# EAGLE schematic Schematic (EAGLE 9.7.0)
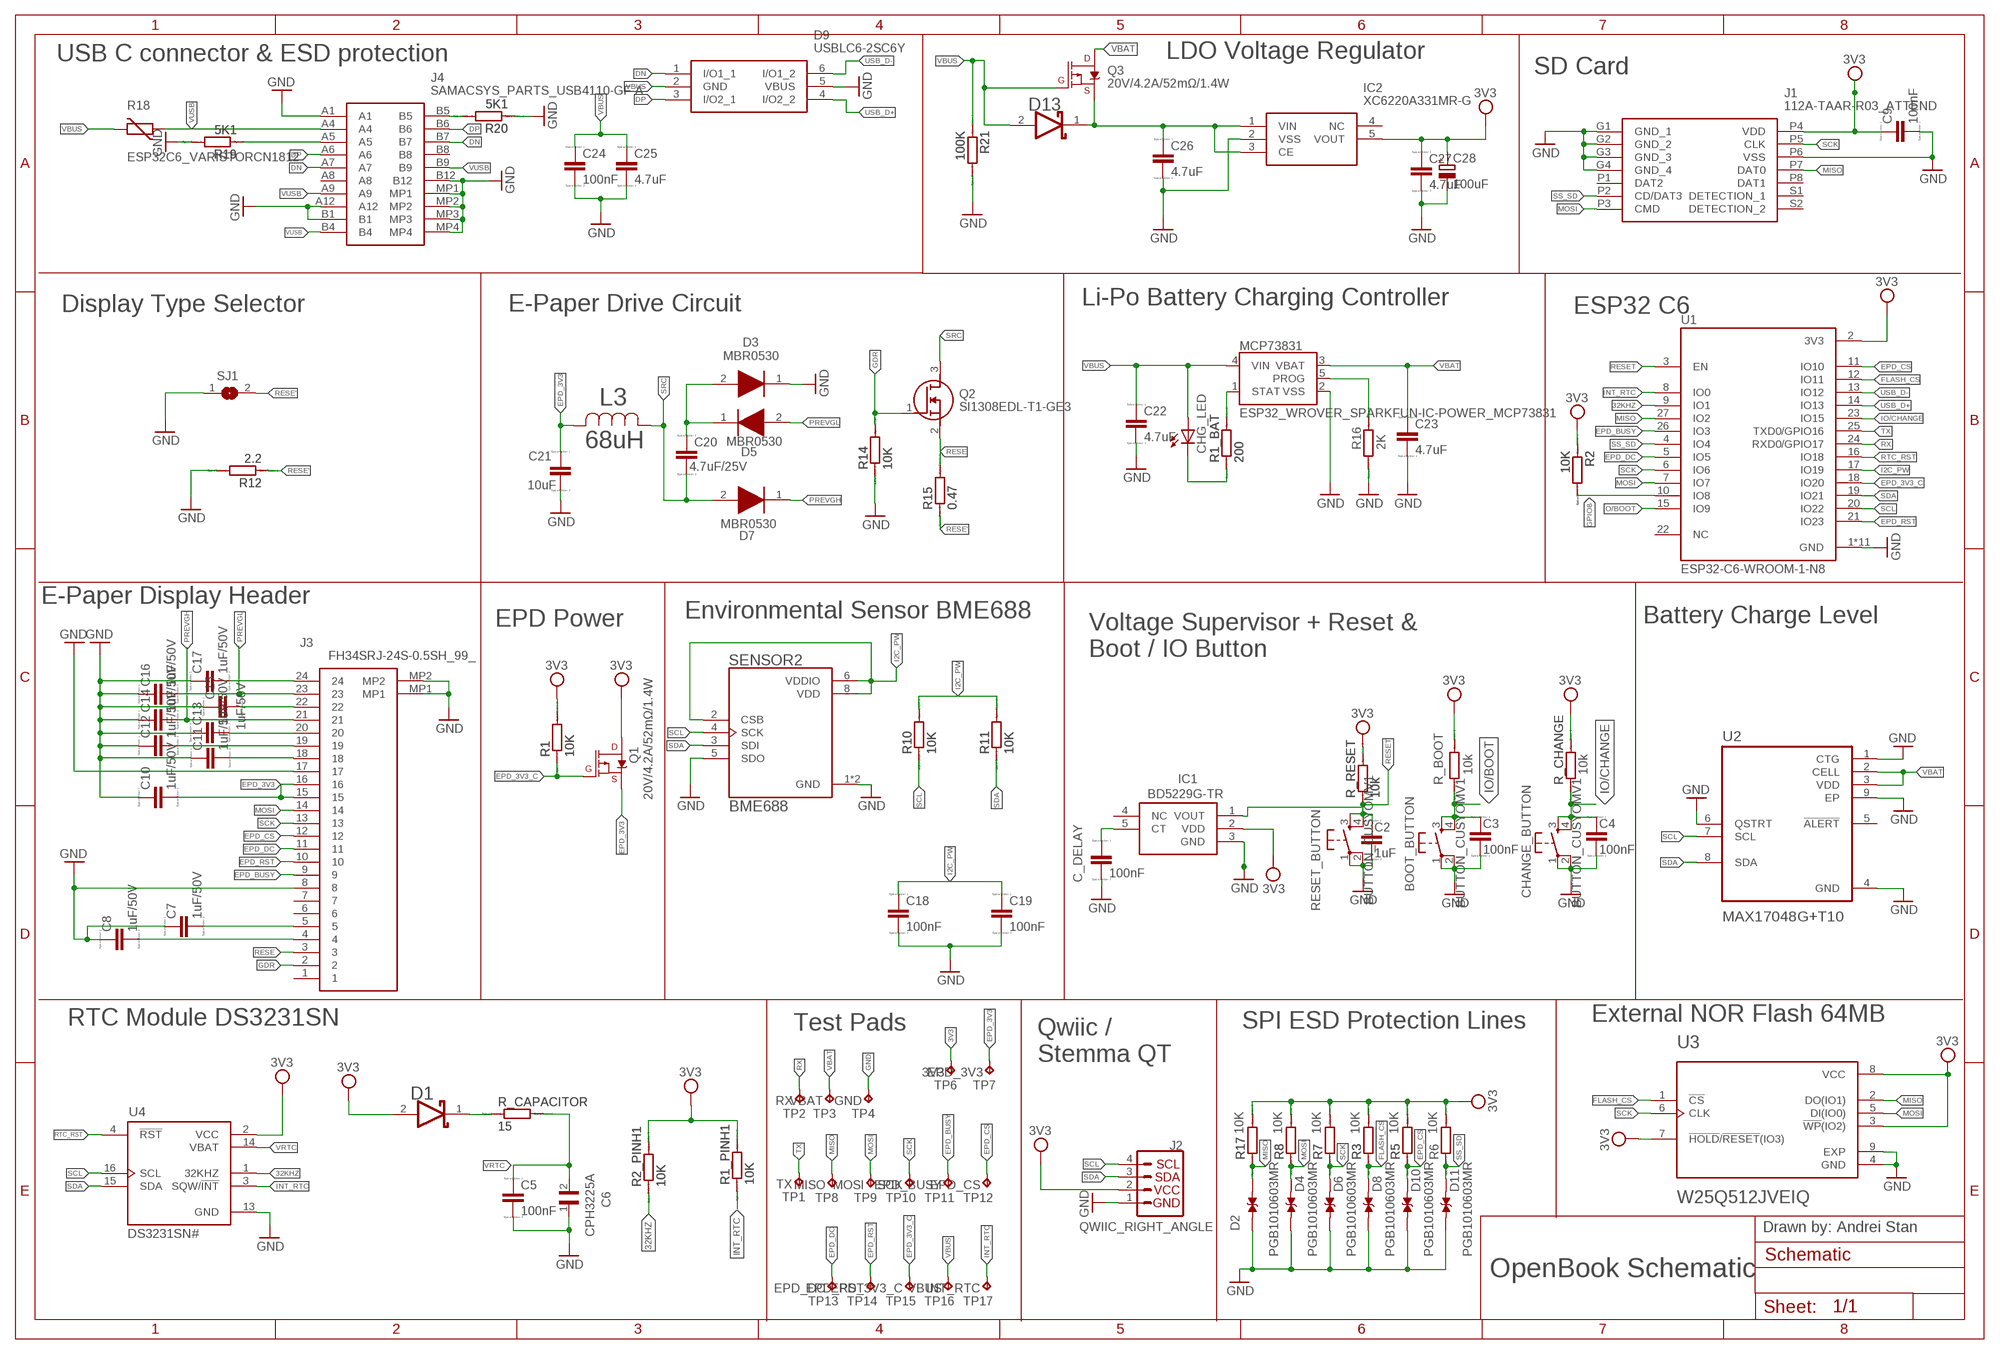
[diagram p0: schematic, sheet 1]

## Parts
BOOT_BUTTON  BUTTON_CUSYOMV1  [MYBUTTON]
C2  1uF  EAGLE-LTSPICE_CC0402  [EAGLE-LTSPICE_C0402]
C3  100nF  EAGLE-LTSPICE_CC0402  [EAGLE-LTSPICE_C0402]
C4  100nF  EAGLE-LTSPICE_CC0402  [EAGLE-LTSPICE_C0402]
C5  100nF  EAGLE-LTSPICE_CC0402  [EAGLE-LTSPICE_C0402]
C6  CPH3225A  [CAPCP3225X100N]
C7  1uF/50V  EAGLE-LTSPICE_CC0402  [EAGLE-LTSPICE_C0402]
C8  1uF/50V  EAGLE-LTSPICE_CC0402  [EAGLE-LTSPICE_C0402]
C9  100nF  EAGLE-LTSPICE_CC0402  [EAGLE-LTSPICE_C0402]
C10  1uF/50V  EAGLE-LTSPICE_CC0402  [EAGLE-LTSPICE_C0402]
C11  1uF/50V  EAGLE-LTSPICE_CC0402  [EAGLE-LTSPICE_C0402]
C12  1uF/50V  EAGLE-LTSPICE_CC0402  [EAGLE-LTSPICE_C0402]
C13  1uF/50V  EAGLE-LTSPICE_CC0402  [EAGLE-LTSPICE_C0402]
C14  1uF/50V  EAGLE-LTSPICE_CC0402  [EAGLE-LTSPICE_C0402]
C15  1uF/50V  EAGLE-LTSPICE_CC0402  [EAGLE-LTSPICE_C0402]
C16  1uF/50V  EAGLE-LTSPICE_CC0402  [EAGLE-LTSPICE_C0402]
C17  1uF/50V  EAGLE-LTSPICE_CC0402  [EAGLE-LTSPICE_C0402]
C18  100nF  EAGLE-LTSPICE_CC0402  [EAGLE-LTSPICE_C0402]
C19  100nF  EAGLE-LTSPICE_CC0402  [EAGLE-LTSPICE_C0402]
C20  4.7uF/25V  ESP32_WROVER_EAGLE-LTSPICE_CC0402  [ESP32_WROVER_EAGLE-LTSPICE_C0402]
C21  10uF  ESP32_WROVER_EAGLE-LTSPICE_CC0402  [ESP32_WROVER_EAGLE-LTSPICE_C0402]
C22  4.7uF  EAGLE-LTSPICE_CC0402  [EAGLE-LTSPICE_C0402]
C23  4.7uF  EAGLE-LTSPICE_CC0402  [EAGLE-LTSPICE_C0402]
C24  100nF  ESP32_WROVER_EAGLE-LTSPICE_CC0402  [ESP32_WROVER_EAGLE-LTSPICE_C0402]
C25  4.7uF  ESP32_WROVER_EAGLE-LTSPICE_CC0402  [ESP32_WROVER_EAGLE-LTSPICE_C0402]
C26  4.7uF  ESP32_WROVER_EAGLE-LTSPICE_CC0402  [ESP32_WROVER_EAGLE-LTSPICE_C0402]
C27  4.7uF  ESP32_WROVER_EAGLE-LTSPICE_CC0402  [ESP32_WROVER_EAGLE-LTSPICE_C0402]
C28  100uF  RCL_CPOL-EUCT3528  [RCL_CT3528]
C_DELAY  100nF  EAGLE-LTSPICE_CC0402  [EAGLE-LTSPICE_C0402]
CHANGE_BUTTON  BUTTON_CUSYOMV1  [MYBUTTON]
CHG_LED  ADAFRUIT_LEDCHIP-LED0603  [ADAFRUIT_CHIP-LED0603]
D1  ESP32_WROVER_AVX---SD0805S020S1R0_AVX_SD0805S020S1R0_0_0AVX_SD0805S020S1R0_0_0  [ESP32_WROVER_AVX---SD0805S020S1R0_AVX_SD0805S020S1R0_0]
D2  PGB1010603MR  [DIOC1608X36N]
D3  MBR0530  [SOD3716X135N]
D4  PGB1010603MR  [DIOC1608X36N]
D5  MBR0530  [SOD3716X135N]
D6  PGB1010603MR  [DIOC1608X36N]
D7  MBR0530  [SOD3716X135N]
D8  PGB1010603MR  [DIOC1608X36N]
D9  USBLC6-2SC6Y  [SOT95P280X145-6N]
D10  PGB1010603MR  [DIOC1608X36N]
D11  PGB1010603MR  [DIOC1608X36N]
D13  ESP32_WROVER_AVX---SD0805S020S1R0_AVX_SD0805S020S1R0_0_0AVX_SD0805S020S1R0_0_0  [ESP32_WROVER_AVX---SD0805S020S1R0_AVX_SD0805S020S1R0_0]
IC1  BD5229G-TR  [SOT95P280X125-5N]
IC2  XC6220A331MR-G  [SOT95P280X120-5N]
J1  112A-TAAR-R03_ATTEND  [112ATAARR03ATTEND]
J2  QWIIC_RIGHT_ANGLE  QWIIC_CONNECTORJS-1MM  [JST04_1MM_RA]
J3  FH34SRJ-24S-0.5SH_99_  [FH34SRJ24S05SH99]
J4  SAMACSYS_PARTS_USB4110-GF-A  [SAMACSYS_PARTS_USB4110GFA]
L3  68uH  744043680IND_4828-WE-TPC_WRE  [IND_4828-WE-TPC_WRE]
MCP73831  ESP32_WROVER_SPARKFUN-IC-POWER_MCP73831  [ESP32_WROVER_SPARKFUN-IC-POWER_SOT23-5]
Q1  20V/4.2A/52mΩ/1.4W  ESP32_WROVER_SPARKFUN-DISCRETESEMI_MOSFET_PCH-DMG2305UX-7  [ESP32_WROVER_SPARKFUN-DISCRETESEMI_SOT23-3]
Q2  SI1308EDL-T1-GE3  [SOT65P210X110-3N]
Q3  20V/4.2A/52mΩ/1.4W  ESP32_WROVER_SPARKFUN-DISCRETESEMI_MOSFET_PCH-DMG2305UX-7  [ESP32_WROVER_SPARKFUN-DISCRETESEMI_SOT23-3]
R1  10K  ESP32_WROVER_EAGLE-LTSPICE_RR0402  [ESP32_WROVER_EAGLE-LTSPICE_R0402]
R1_BAT  200  ESP32_WROVER_EAGLE-LTSPICE_RR0402  [ESP32_WROVER_EAGLE-LTSPICE_R0402]
R1_PINH1  10K  ESP32_WROVER_EAGLE-LTSPICE_RR0402  [ESP32_WROVER_EAGLE-LTSPICE_R0402]
R2  10K  ESP32_WROVER_EAGLE-LTSPICE_RR0402  [ESP32_WROVER_EAGLE-LTSPICE_R0402]
R2_PINH1  10K  ESP32_WROVER_EAGLE-LTSPICE_RR0402  [ESP32_WROVER_EAGLE-LTSPICE_R0402]
R3  10K  ESP32_WROVER_EAGLE-LTSPICE_RR0402  [ESP32_WROVER_EAGLE-LTSPICE_R0402]
R5  10K  ESP32_WROVER_EAGLE-LTSPICE_RR0402  [ESP32_WROVER_EAGLE-LTSPICE_R0402]
R6  10K  ESP32_WROVER_EAGLE-LTSPICE_RR0402  [ESP32_WROVER_EAGLE-LTSPICE_R0402]
R7  10K  ESP32_WROVER_EAGLE-LTSPICE_RR0402  [ESP32_WROVER_EAGLE-LTSPICE_R0402]
R8  10K  ESP32_WROVER_EAGLE-LTSPICE_RR0402  [ESP32_WROVER_EAGLE-LTSPICE_R0402]
R10  10K  ESP32_WROVER_EAGLE-LTSPICE_RR0402  [ESP32_WROVER_EAGLE-LTSPICE_R0402]
R11  10K  ESP32_WROVER_EAGLE-LTSPICE_RR0402  [ESP32_WROVER_EAGLE-LTSPICE_R0402]
R12  2.2  ESP32_WROVER_EAGLE-LTSPICE_RR0402  [ESP32_WROVER_EAGLE-LTSPICE_R0402]
R14  10K  ESP32_WROVER_EAGLE-LTSPICE_RR0402  [ESP32_WROVER_EAGLE-LTSPICE_R0402]
R15  0.47  ESP32_WROVER_EAGLE-LTSPICE_RR0402  [ESP32_WROVER_EAGLE-LTSPICE_R0402]
R16  2K  ESP32_WROVER_EAGLE-LTSPICE_RR0402  [ESP32_WROVER_EAGLE-LTSPICE_R0402]
R17  10K  ESP32_WROVER_EAGLE-LTSPICE_RR0402  [ESP32_WROVER_EAGLE-LTSPICE_R0402]
R18  ESP32C6_VARISTORCN1812  [ESP32C6_VARISTOR_CT/CN1812]
R19  5K1  ESP32_WROVER_EAGLE-LTSPICE_RR0402  [ESP32_WROVER_EAGLE-LTSPICE_R0402]
R20  5K1  ESP32_WROVER_EAGLE-LTSPICE_RR0402  [ESP32_WROVER_EAGLE-LTSPICE_R0402]
R21  100K  ESP32_WROVER_EAGLE-LTSPICE_RR0402  [ESP32_WROVER_EAGLE-LTSPICE_R0402]
R_BOOT  10k  ESP32_WROVER_EAGLE-LTSPICE_RR0402  [ESP32_WROVER_EAGLE-LTSPICE_R0402]
R_CAPACITOR  15  ESP32_WROVER_EAGLE-LTSPICE_RR0402  [ESP32_WROVER_EAGLE-LTSPICE_R0402]
R_CHANGE  10k  ESP32_WROVER_EAGLE-LTSPICE_RR0402  [ESP32_WROVER_EAGLE-LTSPICE_R0402]
R_RESET  10k  ESP32_WROVER_EAGLE-LTSPICE_RR0402  [ESP32_WROVER_EAGLE-LTSPICE_R0402]
RESET_BUTTON  BUTTON_CUSYOMV1  [MYBUTTON]
SENSOR2  BME688  ESP32_WROVER_BME680_BME680  [ESP32_WROVER_BME680_PSON80P300X300X100-8N]
SJ1  SJ  [SJ]
TP1  TPTP20R  [TP20R]
TP2  TPTP20R  [TP20R]
TP3  TPTP20R  [TP20R]
TP4  TPTP20R  [TP20R]
TP6  TPTP20R  [TP20R]
TP7  TPTP20R  [TP20R]
TP8  TPTP20R  [TP20R]
TP9  TPTP20R  [TP20R]
TP10  TPTP20R  [TP20R]
TP11  TPTP20R  [TP20R]
TP12  TPTP20R  [TP20R]
TP13  TPTP20R  [TP20R]
TP14  TPTP20R  [TP20R]
TP15  TPTP20R  [TP20R]
TP16  TPTP20R  [TP20R]
TP17  TPTP20R  [TP20R]
U1  ESP32-C6-WROOM-1-N8  [XCVR_ESP32-C6-WROOM-1-N8]
U2  MAX17048G+T10  [SON50P200X200X80-9N]
U3  W25Q512JVEIQ  [SON127P600X800X80-9N]
U4  DS3231SN#  [SOIC127P1032X265-16N]

## Nets
3V3: C9.1 C27.1 C28.+ D1.2(ANODE) IC1.2(VDD) IC2.5(VOUT) J1.P4(VDD) J2.2 Q1.3(D) R1.2 R1_PINH1.2 R2.1 R2_PINH1.2 R3.2 R5.2 R6.2 R7.2 R8.2 R17.2 R_BOOT.2 R_CHANGE.2 R_RESET.2 TP6.TP U1.2(3V3) U3.3(!WP!(IO2)) U3.7(!HOLD!/!RESET!(IO3)) U3.8(VCC) U4.2(VCC)
32KHZ: R2_PINH1.1 U1.9(IO1) U4.1(32KHZ)
DN: D9.1(I/O1_1) J4.A7 J4.B7
DP: D9.3(I/O2_1) J4.A6 J4.B6
EPD_3V3: C10.2 C21.1 J3.15 J3.16 L3.2 Q1.2(S) TP7.TP
EPD_3V3_C: Q1.1(G) R1.1 TP15.TP U1.18(IO20)
EPD_BUSY: J3.9 TP11.TP U1.26(IO3)
EPD_CS: D10.2 J3.12 R5.1 TP12.TP U1.11(IO10)
EPD_DC: J3.11 TP13.TP U1.5(IO5)
EPD_RST: J3.10 TP14.TP U1.21(IO23)
FLASH_CS: D8.2 R3.1 U1.12(IO11) U3.1(!CS)
GDR: J3.2 Q2.1(G) R14.2
GND: BOOT_BUTTON.1 BOOT_BUTTON.2 C2.2 C3.2 C4.2 C5.2 C6.1 C7.1 C8.1 C9.2 C10.1 C11.1 C12.1 C13.1 C14.1 C15.1 C16.1 C17.1 C18.2 C19.2 C21.2 C22.2 C23.2 C24.2 C25.2 C26.2 C27.2 C28.- C_DELAY.2 CHANGE_BUTTON.1 CHANGE_BUTTON.2 D2.1 D3.1(K) D4.1 D6.1 D8.1 D9.5(VBUS) D10.1 D11.1 IC1.3(GND) IC2.2(VSS) J1.G1(GND_1) J1.G2(GND_2) J1.G3(GND_3) J1.G4(GND_4) J1.P6(VSS) J2.1 J3.8 J3.17 J3.MP1 J3.MP2 J4.A1 J4.A12 J4.B1 J4.B12 J4.MP1 J4.MP2 J4.MP3 J4.MP4 MCP73831.2(VSS) R12.2 R14.1 R16.1 R19.2 R20.1 R21.2 RESET_BUTTON.1 RESET_BUTTON.2 SENSOR2.1(GND) SENSOR2.5(SDO) SENSOR2.7(GND) SJ1.1 TP4.TP U1.1(GND) U1.28(GND) U1.29_1(GND) U1.29_2(GND) U1.29_3(GND) U1.29_4(GND) U1.29_5(GND) U1.29_6(GND) U1.29_7(GND) U1.29_8(GND) U1.29_9(GND) U2.1(CTG) U2.4(GND) U2.6(QSTRT) U2.9(EP) U3.4(GND) U3.9(EXP) U4.13(GND)
GPIO8: R2.2 U1.10(IO8)
I2C_PW: C18.1 C19.1 R10.2 R11.2 SENSOR2.2(CSB) SENSOR2.6(VDDIO) SENSOR2.8(VDD) U1.17(IO19)
INT_RTC: R1_PINH1.1 TP17.TP U1.8(IO0) U4.3(SQW/!INT)
IO/BOOT: BOOT_BUTTON.3 BOOT_BUTTON.4 C3.1 R_BOOT.1 U1.15(IO9)
IO/CHANGE: C4.1 CHANGE_BUTTON.3 CHANGE_BUTTON.4 R_CHANGE.1 U1.23(IO15)
MISO: D2.2 J1.P7(DAT0) R17.1 TP8.TP U1.27(IO2) U3.2(DO(IO1))
MOSI: D4.2 J1.P3(CMD) J3.14 R8.1 TP9.TP U1.7(IO7) U3.5(DI(IO0))
N$1: C_DELAY.1 IC1.5(CT)
N$3: D1.1(CATHODE) R_CAPACITOR.1
N$7: C8.2 J3.4
N$8: C7.2 J3.5
N$9: C20.1 D3.2(A) D5.1(K)
N$10: MCP73831.1(STAT) R1_BAT.2
N$11: J4.A5 R19.1
N$12: CHG_LED.C R1_BAT.1
N$13: MCP73831.5(PROG) R16.2
N$16: J4.B5 R20.2
N$18: C26.1 D13.1(CATHODE) IC2.1(VIN) IC2.3(CE) Q3.2(S)
N$19: C11.2 J3.18
N$20: C12.2 J3.19
N$21: C13.2 J3.20
N$23: C15.2 J3.22
N$25: C17.2 J3.24
PREVGH: C14.2 D7.1(K) J3.21
PREVGL: C16.2 D5.2(A) J3.23
RESE: J3.3 Q2.2(S) R15.2
RESE': R12.1 R15.1 SJ1.2
RESET: C2.1 IC1.1(VOUT) R_RESET.1 RESET_BUTTON.3 RESET_BUTTON.4 U1.3(EN)
RTC_RST: U1.16(IO18) U4.4(!RST)
RX: TP2.TP U1.24(RXD0/GPIO17)
SCK: D6.2 J1.P5(CLK) J3.13 R7.1 TP10.TP U1.6(IO6) U3.6(CLK)
SCL: J2.4 R10.1 SENSOR2.4(SCK) U1.20(IO22) U2.7(SCL) U4.16(SCL)
SDA: J2.3 R11.1 SENSOR2.3(SDI) U1.19(IO21) U2.8(SDA) U4.15(SDA)
SRC: C20.2 D7.2(A) L3.1 Q2.3(D)
SS_SD: D11.2 J1.P2(CD/DAT3) R6.1 U1.4(IO4)
TX: TP1.TP U1.25(TXD0/GPIO16)
USB_D+: D9.4(I/O2_2) U1.14(IO13)
USB_D-: D9.6(I/O1_2) U1.13(IO12)
VBAT: C23.1 MCP73831.3(VBAT) Q3.3(D) TP3.TP U2.2(CELL) U2.3(VDD)
VBUS: C22.1 C24.1 C25.1 CHG_LED.A D9.2(GND) D13.2(ANODE) MCP73831.4(VIN) Q3.1(G) R18.2 R21.1 TP16.TP
VRTC: C5.1 C6.2 R_CAPACITOR.2 U4.14(VBAT)
VUSB: J4.A4 J4.A9 J4.B4 J4.B9 R18.1
Unconnected: IC1.4(NC) IC2.4(NC) J1.P1(DAT2) J1.P8(DAT1) J1.S1(DETECTION_1) J1.S2(DETECTION_2) J3.1 J3.6 J3.7 J4.A8 J4.B8 U1.22(NC) U2.5(!ALERT)

## Notes on the sheet
- USB C connector & ESD protection | LDO Voltage Regulator | SD Card
- Display Type Selector | E-Paper Drive Circuit | Li-Po Battery Charging Controller | ESP32 C6
- E-Paper Display Header
- Environmental Sensor BME688 | Battery Charge Level
- EPD Power
- Voltage Supervisor + Reset &
  Boot / IO Button
- External NOR Flash 64MB
- RTC Module DS3231SN | Test Pads | SPI ESD Protection Lines
- Qwiic /
  Stemma QT
- Drawn by: Andrei Stan
- OpenBook Schematic

## Library data of the parts
BOOT_BUTTON CHANGE_BUTTON RESET_BUTTON = DeskAssistant v19 v1:BUTTON_CUSYOMV1; DATASHEET: https://4donline.ihs.com/images/VipMasterIC/IC/PANA/PANAS45028/PANAS45028-1.pdf?hkey=CECEF36DEECDED6468708AAF2E19C0C6; MOUSER_PRICE-STOCK: https://ro.mouser.com/ProductDetail/Panasonic/EVQ-9P701P?qs=NPkb10g2yLBKCwpELvsGNg%3D%3D
C2-C5 C7-C19 C22 C23 C_DELAY = DeskAssistant v19 v1:EAGLE-LTSPICE_C: CAPACITOR, European symbol; DATASHEET: https://ro.mouser.com/datasheet/2/447/KEM_C1006_X5R_SMD-3316465.pdf; MOUSER_PRICE-STOCK: https://ro.mouser.com/ProductDetail/KEMET/C0402C475K8PACTU?qs=sGAEpiMZZMsh%252B1woXyUXj%252BeMYF%2FJh1ZHWLnD7xub%252BoY%3D; SPICEMODEL: NONE; SPICEPREFIX: C
C6 = DeskAssistant v19 v1:CPH3225A: Cap 0.011F 3.3V 1210 Flat Check availability <https://pricing.snapeda.com/parts/CPH3225A/Seiko%20Instruments/view-part?ref=eda>; AVAILABILITY: Not in stock; CHECK_PRICES: https://www.snapeda.com/parts/CPH3225A/Seiko+Instruments/view-part/?ref=eda; DATASHEET: https://mm.digikey.com/Volume0/opasdata/d220001/medias/docus/6537/rev05-CPHCPM.pdf; DESCRIPTION: 11 mF (EDLC) Supercapacitor 3.3 V 1210 (3225 Metric) - -; MF: Seiko Instruments; MP: CPH3225A; PACKAGE: 1210 Seiko; PRICE: None; PURCHASE-URL: https://www.snapeda.com/api/url_track_click_mouser/?unipart_id=562593&manufacturer=Seiko Instruments&part_name=CPH3225A&search_term=None; SNAPEDA_LINK: https://www.snapeda.com/parts/CPH3225A/Seiko+Instruments/view-part/?ref=snap
C20 C21 C24-C27 = DeskAssistant v19 v2:ESP32_WROVER_EAGLE-LTSPICE_C: CAPACITOR, European symbol; DATASHEET: https://ro.mouser.com/datasheet/2/447/KEM_C1006_X5R_SMD-3316465.pdf; MOUSER_PRICE-STOCK: https://ro.mouser.com/ProductDetail/KEMET/C0402C475K8PACTU?qs=sGAEpiMZZMsh%252B1woXyUXj%252BeMYF%2FJh1ZHWLnD7xub%252BoY%3D; SPICEMODEL: NONE; SPICEPREFIX: C
C28 = DeskAssistant v19 v2:RCL_CPOL-EU: POLARIZED CAPACITOR, European symbol; DATASHEET: https://ro.mouser.com/datasheet/2/447/KEM_T2073_T59X-3316825.pdf; MOUSER_PRICE-STOCK: https://ro.mouser.com/ProductDetail/KEMET/T598B335M035ATE150?qs=sGAEpiMZZMsh%252B1woXyUXj9kQnrMN1UR3%252B%2FX%2FiUkAw%2Fg%3D; SPICEPREFIX: C
CHG_LED = DeskAssistant v19 v1:ADAFRUIT_LED: LED OSRAM: - CHIPLED LG R971, LG N971, LY N971, LG Q971, LY Q971, LO R971, LY R971 LH N974, LH R974 LS Q976, LO Q976, LY Q976 LO Q996 - Hyper CHIPLED LW Q18S LB Q993, LB Q99A, LB R99A - SideLED LS A670, LO A670, LY A670, LG A670, LP A670 LB A673, LV A673, LT A673, LW A673 LH A674 LY A675 LS A676, LA A676, LO A676, LY A676, LW A676 LS A679, LY A679, LG A679 - Hyper Micro SIDELED® LS Y876, LA Y876, LO Y876, LY Y876 LT Y87S - SmartLED LW L88C, LW L88S LB L89C, LB L89S, LG L890 LS L89K, LO L89K, LY L89K LS L896, LA L896, LO L896, LY L896 - TOPLED LS T670, LO T670, LY T670, LG T670, LP T670 LSG T670, LSP T670, LSY T670, LOP T670, LYG T670 LG T671, LOG T671, LSG T671 LB T673, LV T673, LT T673, LW T673 LH T674 LS T676, LA T676, LO T676, LY T676, LB T676, LH T676, LSB T676, LW T676 LB T67C, LV T67C, LT T67C, LS T67K, LO T67K, LY T67K, LW E67C LS E67B, LA E67B, LO E67B, LY E67B, LB E67C, LV E67C, LT E67C LW T67C LS T679, LY T679, LG T679 LS T770, LO T770, LY T770, LG T770, LP T770 LB T773, LV T773, LT T773, LW T773 LH T774 LS E675, LA E675, LY E675, LS T675 LS T776, LA T776, LO T776, LY T776, LB T776 LHGB T686 LT T68C, LB T68C - Hyper Mini TOPLED® LB M676 - Mini TOPLED Santana® LG M470 LS M47K, LO M47K, LY M47K Source: http://www.osram.convergy.de/; DATASHEET: https://www.vishay.com/doc?82437; MOUSER_PRICE-STOCK: https://ro.mouser.com/ProductDetail/Vishay-Semiconductors/VLMY1301-GS08?qs=sGAEpiMZZMusoohG2hS%252B168PbK3WnfgfiGSE4pxVBaDPiKIho6Ieew%3D%3D
D1 = DeskAssistant v19 v1:ESP32_WROVER_AVX---SD0805S020S1R0_AVX_SD0805S020S1R0_0_0: Schottky Barrier Rectifier Diode; CENTROID_NOT_SPECIFIED: No; DATASHEET: http://datasheets.avx.com/schottky.pdf; DIGIKEY_DESCRIPTION: DIODE SCHOTTKY 20V 1A 0805; DIGIKEY_PART_NUMBER: 478-7800-1-ND; LEAD_FREE: yes; MF: AVX; MOUSER_PART_NUMBER: 581-SD0805S020S1R0; PACKAGE: 0805 (2012 metric); PREFIX: D; ROHS: yes; TEMPERATURE_RANGE_HIGH: +125°C; TEMPERATURE_RANGE_LOW: -55°C
D2 D4 D6 D8 D10 D11 = DeskAssistant v19 v2:PGB1010603MR: Check availability <https://pricing.snapeda.com/parts/PGB1010603MR/Littelfuse%20Inc./view-part?ref=eda>; AVAILABILITY: In Stock; CHECK_PRICES: https://www.snapeda.com/parts/PGB1010603MR/Littelfuse/view-part/?ref=eda; DATASHEET: https://www.littelfuse.com/assetdocs/pulseguard-esd-suppressors-pgb1-datasheet?assetguid=8a337998-d54d-466b-be4e-dc5bcd1f9321; DESCRIPTION: 150V (Typ) Clamp - Ipp Tvs Diode Surface Mount 0603 (1608 Metric); MF: Littelfuse Inc.; MP: PGB1010603MR; PACKAGE: 0603 Littelfuse Inc.; PRICE: None; PURCHASE-URL: https://www.snapeda.com/api/url_track_click_mouser/?unipart_id=5659453&manufacturer=Littelfuse Inc.&part_name=PGB1010603MR&search_term=None; SNAPEDA_LINK: https://www.snapeda.com/parts/PGB1010603MR/Littelfuse/view-part/?ref=snap
D3 D5 D7 = DeskAssistant v19 v2:MBR0530: ON SEMICONDUCTOR - MBR0530 - DIODE, SCHOTTKY, 0.5A, 30V, SOD-123 Source: Datasheet <http://www.onsemi.com/pub/Collateral/MBR0530T1-D.PDF> Check availability <https://pricing.snapeda.com/parts/MBR0530/ON%20Semiconductor/view-part?ref=eda>; AVAILABILITY: In Stock; CHECK_PRICES: https://www.snapeda.com/parts/MBR0530/Onsemi/view-part/?ref=eda; DATASHEET: https://www.onsemi.cn/pdf/datasheet/mbr0530-d.pdf; DESCRIPTION: Diode Schottky 30 V 500mA Surface Mount SOD-123; MF: ON Semiconductor; MP: MBR0530; PACKAGE: SOD-123-2 ON Semiconductor; PRICE: None; PURCHASE-URL: https://www.snapeda.com/api/url_track_click_mouser/?unipart_id=179458&manufacturer=ON Semiconductor&part_name=MBR0530&search_term=None; SNAPEDA_LINK: https://www.snapeda.com/parts/MBR0530/Onsemi/view-part/?ref=snap
D9 = DeskAssistant v19 v2:USBLC6-2SC6Y: Low Cap. ESD Protection Auto SOT-23-6 STMicroelectronics USBLC6-2SC6Y, Dual Uni-Directional TVS Diode Array, 6-Pin SOT-23 Source: Datasheet <https://componentsearchengine.com/Datasheets/1/USBLC6-2SC6Y.pdf> Check availability <https://pricing.snapeda.com/parts/USBLC6-2SC6Y/STMicroelectronics/view-part?ref=eda>; AVAILABILITY: In Stock; CHECK_PRICES: https://www.snapeda.com/parts/USBLC6-2SC6Y/STMicroelectronics/view-part/?ref=eda; DATASHEET: https://ro.mouser.com/datasheet/2/389/usblc6_2sc6y-1852505.pdf; DESCRIPTION: 17V Clamp 5A (8/20µs) Ipp Tvs Diode Surface Mount SOT-23-6; MF: STMicroelectronics; MOUSER_PRICE-STOCK: https://ro.mouser.com/ProductDetail/STMicroelectronics/USBLC6-2SC6Y?utm_campaign=mouser&qs=gNDSiZmRJS%2FOgDexvXkdow==&utm_medium=online&utm_source=snapedaonline&utm_content=model; MP: USBLC6-2SC6Y; PACKAGE: SOT-23-6 STMicroelectronics; PRICE: None; SNAPEDA_LINK: https://www.snapeda.com/parts/USBLC6-2SC6Y/STMicroelectronics/view-part/?ref=snap
D13 = DeskAssistant v19 v2:ESP32_WROVER_AVX---SD0805S020S1R0_AVX_SD0805S020S1R0_0_0: Schottky Barrier Rectifier Diode; CENTROID_NOT_SPECIFIED: No; DATASHEET: http://datasheets.avx.com/schottky.pdf; DIGIKEY_DESCRIPTION: DIODE SCHOTTKY 20V 1A 0805; DIGIKEY_PART_NUMBER: 478-7800-1-ND; LEAD_FREE: yes; MF: AVX; MOUSER_PART_NUMBER: 581-SD0805S020S1R0; PACKAGE: 0805 (2012 metric); PREFIX: D; ROHS: yes; TEMPERATURE_RANGE_HIGH: +125°C; TEMPERATURE_RANGE_LOW: -55°C
IC1 = DeskAssistant v19 v1:BD5229G-TR: Voltage Detector with Adjustable Delay Time: CMOS processes are utilized to develop high precision, low current consumption CMOS reset ICs that allow arbitrary setting of the delay time. The extensive lineup includes both Nch Open Drain and CMOS output types in a wide range of detection voltages (from 2.3V to 6.0V, in 0.1V steps), enabling selection of the ideal solution based on customer requirements. In addition, the entire series is of course both lead-free and RoHS-compliant. Source: Datasheet <https://datasheet.datasheetarchive.com/originals/distributors/Datasheets_SAMA/f2b9741ef86007909f138d561a359946.pdf>; DATASHEET: https://fscdn.rohm.com/en/products/databook/datasheet/ic/power/voltage_detector/bd52xxg-e.pdf; DESCRIPTION: Voltage Detector with Adjustable Delay Time: CMOS processes are utilized to develop high precision, low current consumption CMOS reset ICs that allow arbitrary setting of the delay time. The extensive lineup includes both Nch Open Drain and CMOS output types in a wide range of detection voltages (from 2.3V to 6.0V, in 0.1V steps), enabling selection of the ideal solution based on customer requirements. In addition, the entire series is of course both lead-free and RoHS-compliant.; HEIGHT: 1.25mm; MANUFACTURER_NAME: ROHM Semiconductor; MANUFACTURER_PART_NUMBER: BD5229G-TR; MOUSER_PART_NUMBER: 755-BD5229G-TR; MOUSER_PRICE-STOCK: https://www.mouser.co.uk/ProductDetail/ROHM-Semiconductor/BD5229G-TR?qs=4kLU8WoGk0vvnhrrYwdszw%3D%3D
IC2 = DeskAssistant v19 v2:XC6220A331MR-G: LDO Voltage Regulators Source: Datasheet <https://www.torexsemi.com/file/xc6220/XC6220.pdf>; DATASHEET: https://ro.mouser.com/datasheet/2/760/xc6220-3371556.pdf; DESCRIPTION: LDO Voltage Regulators; HEIGHT: 1.2mm; MANUFACTURER_NAME: Torex; MANUFACTURER_PART_NUMBER: XC6220A331MR-G; MOUSER_PART_NUMBER: 865-XC6220A331MR-G; MOUSER_PRICE-STOCK: https://www.mouser.co.uk/ProductDetail/Torex-Semiconductor/XC6220A331MR-G?qs=AsjdqWjXhJ8ZSWznL1J0gg%3D%3D
J1 = DeskAssistant v19 v1:112A-TAAR-R03_ATTEND: Micro SD Card Socket, Push-Push Type, Top Mount, SMT, H=1.83mm, 10u Source: Datasheet <https://www.attend.com.tw/data/download/file/112A-TAAR-R03.pdf>; DATASHEET: https://www.attend.com.tw/data/download/file/112A-TAAR-R03_Spec.pdf; DESCRIPTION: Micro SD Card Socket, Push-Push Type, Top Mount, SMT, H=1.83mm, 10u; HEIGHT: 1.9mm; MANUFACTURER_NAME: ATTEND; MANUFACTURER_PART_NUMBER: 112A-TAAR-R03 ATTEND; MOUSER_PRICE-STOCK: https://www.digikey.com/en/products/detail/attend-technology/112A-TAAR-R03/17633923
J2 = DeskAssistant v19 v1:QWIIC_CONNECTOR: SparkFun I2C Standard Qwiic Connector An SMD 1mm pitch JST connector makes it easy and quick (get it? Qwiic?) to connect I2C devices to each other. The Qwiic system <http://www.sparkfun.com/qwiic> enables fast and solderless connection between popular platforms and various sensors and actuators. We carry 200mm <https://www.sparkfun.com/products/14204>, 100mm <https://www.sparkfun.com/products/14205>, 50mm <https://www.sparkfun.com/products/14206>, and breadboard friendly <https://www.sparkfun.com/products/14207> Qwiic cables. We also offer 10 pcs strips <https://www.sparkfun.com/products/14323> the SMD connectors.; DATASHEET: https://ro.mouser.com/datasheet/2/813/Qwiic_Connector_Datasheet-1223982.pdf; MOUSER_PRICE-STOCK: https://ro.mouser.com/ProductDetail/SparkFun/PRT-14417?qs=wd5RIQLrsJhgdz%2FpmZ%2F3GQ%3D%3D&srsltid=AfmBOoqQ1oOwS9wen4cUg5-iBLh8Bm57R1iVLhkDmOc94Djde0aRxIcK; PROD_ID: CONN-13694
J3 = DeskAssistant v19 v1:FH34SRJ-24S-0.5SH_99_: 24 Position FFC, FPC Connector Contacts, Top and Bottom 0.020" (0.50mm) Surface Mount, Right Angle Source: Datasheet <https://www.hirose.com/en/product/document?clcode=CL0580-1255-6-99&productname=FH34SRJ-24S-0.5SH(99)&series=FH34SRJ&documenttype=2DDrawing&lang=en&documentid=0000990903>; DATASHEET: https://ro.mouser.com/datasheet/2/185/FH34SRJ_24S_0_5SH_99__CL0580_1255_6_99_2DDrawing_0-1615044.pdf; DESCRIPTION: 24 Position FFC, FPC Connector Contacts, Top and Bottom 0.020" (0.50mm) Surface Mount, Right Angle; HEIGHT: 1.1mm; MANUFACTURER_NAME: Hirose; MANUFACTURER_PART_NUMBER: FH34SRJ-24S-0.5SH(99); MOUSER_PART_NUMBER: 798-FH34SRJ24S05SH99; MOUSER_PRICE-STOCK: https://www.mouser.co.uk/ProductDetail/Hirose-Connector/FH34SRJ-24S-0.5SH99?qs=vcbW%252B4%252BSTIpKBl5ap9J8Fw%3D%3D
J4 = DeskAssistant v19 v2:SAMACSYS_PARTS_USB4110-GF-A: CONN USB 2.0 TYPE-C R/A SMT Source: Datasheet <https://gct.co/files/drawings/usb4110.pdf>; DATASHEET: https://ro.mouser.com/datasheet/2/837/GCT_USB4110_Product_Drawing___20k_cycles-3455479.pdf; DESCRIPTION: CONN USB 2.0 TYPE-C R/A SMT; HEIGHT: 3.26mm; MANUFACTURER_NAME: GCT (GLOBAL CONNECTOR TECHNOLOGY); MANUFACTURER_PART_NUMBER: USB4110-GF-A; MOUSER_PART_NUMBER: 640-USB4110-GF-A; MOUSER_PRICE-STOCK: https://www.mouser.co.uk/ProductDetail/GCT/USB4110-GF-A?qs=KUoIvG%2F9IlYiZvIXQjyJeA%3D%3D
L3 = DeskAssistant v19 v2:744043680; COPYRIGHT: Copyright (C) 2024 Ultra Librarian. All rights reserved.; DATASHEET: https://www.we-online.com/components/products/datasheet/744043680.pdf; MANUFACTURER_PART_NUMBER: 744043680; MFR_NAME: Wurth Electronics; MOUSER_PRICE-STOCK: https://ro.mouser.com/ProductDetail/Wurth-Elektronik/744043680?qs=PGXP4M47uW6VkZq%252BkzjrHA%3D%3D&srsltid=AfmBOoq3PLABygfB0-85eEKpA9SffUYwty425nbkhbFJ01kDNoAxFF7J
MCP73831 = DeskAssistant v19 v1:ESP32_WROVER_SPARKFUN-IC-POWER_MCP73831: MCP73831T Li-Ion, Li-Pol Controller Miniature single cell, fully integrated Li-Ion, Li-polymer charge management controller Datasheet <http://ww1.microchip.com/downloads/en/DeviceDoc/20001984g.pdf> SparkFun Products: SparkFun ESP32 Thing <https://www.sparkfun.com/products/13907> SparkFun 9DoF Razor IMU M0 <https://www.sparkfun.com/products/14001>; DATASHEET: https://ro.mouser.com/datasheet/2/268/MCP73831_Family_Data_Sheet_DS20001984H-3441711.pdf; MOUSER_PRICE-STOCK: https://www.mouser.dk/ProductDetail/Microchip-Technology/MCP73831T-3ACI-OT?qs=yUQqVecv4quInAWkk8YFWg%3D%3D; PROD_ID: IC-09995
Q1 = DeskAssistant v19 v1:ESP32_WROVER_SPARKFUN-DISCRETESEMI_MOSFET_PCH: P-channel MOSFETs Voltage controlled devices that allow control of high current outputs. SparkFun Products: SparkFun ESP32 Thing <https://www.sparkfun.com/products/13907> SparkFun ESP8266 Thing <https://www.sparkfun.com/products/13231> SparkFun Pi Servo HAT V2 <https://www.sparkfun.com/products/15316> DMG2305UX-7 (20V/4.2A/SOT23-3); DATASHEET: https://www.diodes.com/assets/Datasheets/DMG2305UX.pdf; MOUSER_PRICE-STOCK: https://www.digikey.ro/en/products/detail/diodes-incorporated/DMG2305UX-7/4340667; PROD_ID: TRAN-14388
Q2 = DeskAssistant v19 v2:SI1308EDL-T1-GE3: MOSFET N-Ch 30V 1.5A TrenchFET SC70 Vishay Si1308EDL-T1-GE3 N-channel MOSFET Transistor, 1.5 A, 30 V, 3-Pin SC-70 Source: Datasheet <https://componentsearchengine.com/Datasheets/1/SI1308EDL-T1-GE3.pdf> Check availability <https://pricing.snapeda.com/parts/SI1308EDL-T1-GE3/Vishay%20Siliconix/view-part?ref=eda>; AVAILABILITY: In Stock; CHECK_PRICES: https://www.snapeda.com/parts/SI1308EDL-T1-GE3/Vishay+Siliconix/view-part/?ref=eda; DATASHEET: https://www.vishay.com/docs/63399/si1308edl.pdf; DESCRIPTION: Si1308EDL-T1-GE3 N-channel MOSFET Transistor, 1.5 A, 30 V, 3-Pin SC-70 | Siliconix / Vishay SI1308EDL-T1-GE3; MF: Vishay Siliconix; MP: SI1308EDL-T1-GE3; PACKAGE: SOT-323 Vishay Semiconductor; PRICE: None; PURCHASE-URL: https://www.snapeda.com/api/url_track_click_mouser/?unipart_id=274603&manufacturer=Vishay Siliconix&part_name=SI1308EDL-T1-GE3&search_term=None; SNAPEDA_LINK: https://www.snapeda.com/parts/SI1308EDL-T1-GE3/Vishay+Siliconix/view-part/?ref=snap
Q3 = DeskAssistant v19 v2:ESP32_WROVER_SPARKFUN-DISCRETESEMI_MOSFET_PCH: P-channel MOSFETs Voltage controlled devices that allow control of high current outputs. SparkFun Products: SparkFun ESP32 Thing <https://www.sparkfun.com/products/13907> SparkFun ESP8266 Thing <https://www.sparkfun.com/products/13231> SparkFun Pi Servo HAT V2 <https://www.sparkfun.com/products/15316> DMG2305UX-7 (20V/4.2A/SOT23-3); DATASHEET: https://www.diodes.com/assets/Datasheets/DMG2305UX.pdf; MOUSER_PRICE-STOCK: https://www.digikey.ro/en/products/detail/diodes-incorporated/DMG2305UX-7/4340667; PROD_ID: TRAN-14388
R1 R1_BAT R1_PINH1 R2 R2_PINH1 R3 R5-R8 R10-R12 R16 R17 R19-R21 R_BOOT R_CAPACITOR R_CHANGE R_RESET = DeskAssistant v19 v1:ESP32_WROVER_EAGLE-LTSPICE_R: RESISTOR, European symbol; DATASHEET: https://www.vishay.com/doc?20035; MOUSER_PART_NUMBER: https://eu.mouser.com/ProductDetail/Vishay-Dale/CRCW040240K2FKED?qs=rzhQWu8UUS3g49JmcwYN7w%3D%3D&utm_id=20109199409&utm_source=google&utm_medium=cpc&utm_marketing_tactic=emeacorp&gad_source=1&gclid=EAIaIQobChMI4vv9kZaojAMV7YKDBx2W9Ae5EAAYAiAAEgK9cfD_BwE; SPICEMODEL: NONE; SPICEPREFIX: R
R14 R15 = DeskAssistant v19 v2:ESP32_WROVER_EAGLE-LTSPICE_R: RESISTOR, European symbol; DATASHEET: https://www.vishay.com/doc?20035; MOUSER_PRICE-STOCK: https://ro.mouser.com/ProductDetail/Vishay-Dale/CRCW040240K2FKED?qs=rzhQWu8UUS3g49JmcwYN7w%3D%3D&utm_id=20109199409&utm_source=google&utm_medium=cpc&utm_marketing_tactic=emeacorp&gad_source=1&gclid=EAIaIQobChMI4vv9kZaojAMV7YKDBx2W9Ae5EAAYAiAAEgK9cfD_BwE; SPICEMODEL: NONE; SPICEPREFIX: R
R18 = DeskAssistant v19 v2:ESP32C6_VARISTOR: VARISTOR; DATASHEET: https://mm.digikey.com/Volume0/opasdata/d220001/medias/docus/2123/CTVS_Standard_Rev2015.pdf; MOUSER_PRICE-STOCK: https://www.digikey.be/en/products/detail/epcos-tdk-electronics/CN1812K11G/635074?srsltid=AfmBOora8jXqSIsuJ5wbLbjXOKEBe4X6EtjlDXrR_O7ItUtFQ009LUoi
SENSOR2 = DeskAssistant v19 v1:ESP32_WROVER_BME680_BME680: Integrated Environmental Unit; AVAILABILITY: Unavailable; DATASHEET: https://ro.mouser.com/datasheet/2/783/BST_BME680_DS001-1509608.pdf; DESCRIPTION: Integrated Environmental Unit; MF: Bosch Sensortec; MOUSER_PRICE-STOCK: https://ro.mouser.com/ProductDetail/Bosch-Sensortec/BME680?qs=v271MhAjFHjo0yA%2FC4OnDQ%3D%3D; MP: BME680; PACKAGE: LGA-8 Bosch Tools; PRICE: None
SJ1 = DeskAssistant v19 v1:SJ: SMD solder JUMPER
TP1 = DeskAssistant v19 v1:TP: Test pad; TP_SIGNAL_NAME: TX
TP2 = DeskAssistant v19 v1:TP: Test pad; TP_SIGNAL_NAME: RX
TP3 = DeskAssistant v19 v1:TP: Test pad; TP_SIGNAL_NAME: VBAT
TP4 = DeskAssistant v19 v1:TP: Test pad; TP_SIGNAL_NAME: GND
TP6 = DeskAssistant v19 v1:TP: Test pad; TP_SIGNAL_NAME: 3V3
TP7 = DeskAssistant v19 v1:TP: Test pad; TP_SIGNAL_NAME: EPD_3V3
TP8 = DeskAssistant v19 v1:TP: Test pad; TP_SIGNAL_NAME: MISO
TP9 = DeskAssistant v19 v1:TP: Test pad; TP_SIGNAL_NAME: MOSI
TP10 = DeskAssistant v19 v1:TP: Test pad; TP_SIGNAL_NAME: SCK
TP11 = DeskAssistant v19 v1:TP: Test pad; TP_SIGNAL_NAME: EPD_BUSY
TP12 = DeskAssistant v19 v1:TP: Test pad; TP_SIGNAL_NAME: EPD_CS
TP13 = DeskAssistant v19 v1:TP: Test pad; TP_SIGNAL_NAME: EPD_DC
TP14 = DeskAssistant v19 v1:TP: Test pad; TP_SIGNAL_NAME: EPD_RST
TP15 = DeskAssistant v19 v1:TP: Test pad; TP_SIGNAL_NAME: EPD_3V3_C
TP16 = DeskAssistant v19 v1:TP: Test pad; TP_SIGNAL_NAME: VBUS
TP17 = DeskAssistant v19 v1:TP: Test pad; TP_SIGNAL_NAME: INT_RTC
U1 = DeskAssistant v19 v1:ESP32-C6-WROOM-1-N8: Check availability <https://pricing.snapeda.com/parts/ESP32-C6-WROOM-1-N8/Espressif%20Systems/view-part?ref=eda>; AVAILABILITY: In Stock; CHECK_PRICES: https://www.snapeda.com/parts/ESP32-C6-WROOM-1-N8/Espressif+Systems/view-part/?ref=eda; DATASHEET: https://www.espressif.com/sites/default/files/documentation/esp32-c6-wroom-1_wroom-1u_datasheet_en.pdf; DESCRIPTION: Multiprotocol Modules ESP32-C6 module, Wi-Fi 6 in 2.4 GHz band, Bluetooth 5, Zigbee 3.0 and Thread. ESP34-WROOM Compatible - ENGINEERING SAMPLE; MF: Espressif Systems; MP: ESP32-C6-WROOM-1-N8; PACKAGE: None; PRICE: None; SNAPEDA_LINK: https://www.snapeda.com/parts/ESP32-C6-WROOM-1-N8/Espressif+Systems/view-part/?ref=snap
U2 = DeskAssistant v19 v1:MAX17048G+T10: Check availability <https://pricing.snapeda.com/parts/MAX17048G%2BT10/Analog%20Devices/view-part?ref=eda>; AVAILABILITY: In Stock; CHECK_PRICES: https://www.snapeda.com/parts/MAX17048G+T10/Analog+Devices/view-part/?ref=eda; DATASHEET: https://ro.mouser.com/datasheet/2/609/MAX17048_MAX17049-3469099.pdf; DESCRIPTION: 3µA 1-Cell/2-Cell Fuel Gauge with ModelGauge; MF: Analog Devices; MP: MAX17048G+T10; PACKAGE: TDFN-8 Maxim; PRICE: None; PURCHASE-URL: https://www.snapeda.com/api/url_track_click_mouser/?unipart_id=329239&manufacturer=Analog Devices&part_name=MAX17048G+T10&search_term=None; SNAPEDA_LINK: https://www.snapeda.com/parts/MAX17048G+T10/Analog+Devices/view-part/?ref=snap
U3 = DeskAssistant v19 v1:W25Q512JVEIQ: Check availability <https://pricing.snapeda.com/parts/W25Q512JVEIQ/Winbond%20Electronics/view-part?ref=eda>; AVAILABILITY: In Stock; CHECK_PRICES: https://www.snapeda.com/parts/W25Q512JVEIQ/Winbond+Electronics/view-part/?ref=eda; DATASHEET: https://www.winbond.com/resource-files/W25Q512JV%20SPI%20RevB%2006252019%20KMS.pdf; DESCRIPTION: FLASH - NOR Memory IC 512Mb (64M x 8) SPI - Quad I/O 133 MHz 8-WSON (8x6); MF: Winbond Electronics; MP: W25Q512JVEIQ; PACKAGE: Package; PRICE: None; SNAPEDA_LINK: https://www.snapeda.com/parts/W25Q512JVEIQ/Winbond+Electronics/view-part/?ref=snap
U4 = DeskAssistant v19 v1:DS3231SN#: Real Time Clock Serial 16-Pin SOIC W T/R Check availability <https://pricing.snapeda.com/parts/DS3231SN%23/Analog%20Devices/view-part?ref=eda>; AVAILABILITY: In Stock; CHECK_PRICES: https://www.snapeda.com/parts/DS3231SN%23/Analog+Devices/view-part/?ref=eda; DATASHEET: https://ro.mouser.com/datasheet/2/609/DS3231-3421123.pdf; DESCRIPTION: Extremely Accurate I²C-Integrated RTC/TCXO/Crystal; MF: Analog Devices; MP: DS3231SN#; PACKAGE: SOIC-16 Maxim; PRICE: None; PURCHASE-URL: https://www.snapeda.com/api/url_track_click_mouser/?unipart_id=99048&manufacturer=Analog Devices&part_name=DS3231SN#&search_term=None; SNAPEDA_LINK: https://www.snapeda.com/parts/DS3231SN%23/Analog+Devices/view-part/?ref=snap